# Altium schematic sheet 06_SOM_USB_CARD.SchDoc
size 420 x 297 mm; SheetNumber: 10; SheetTotal: 29
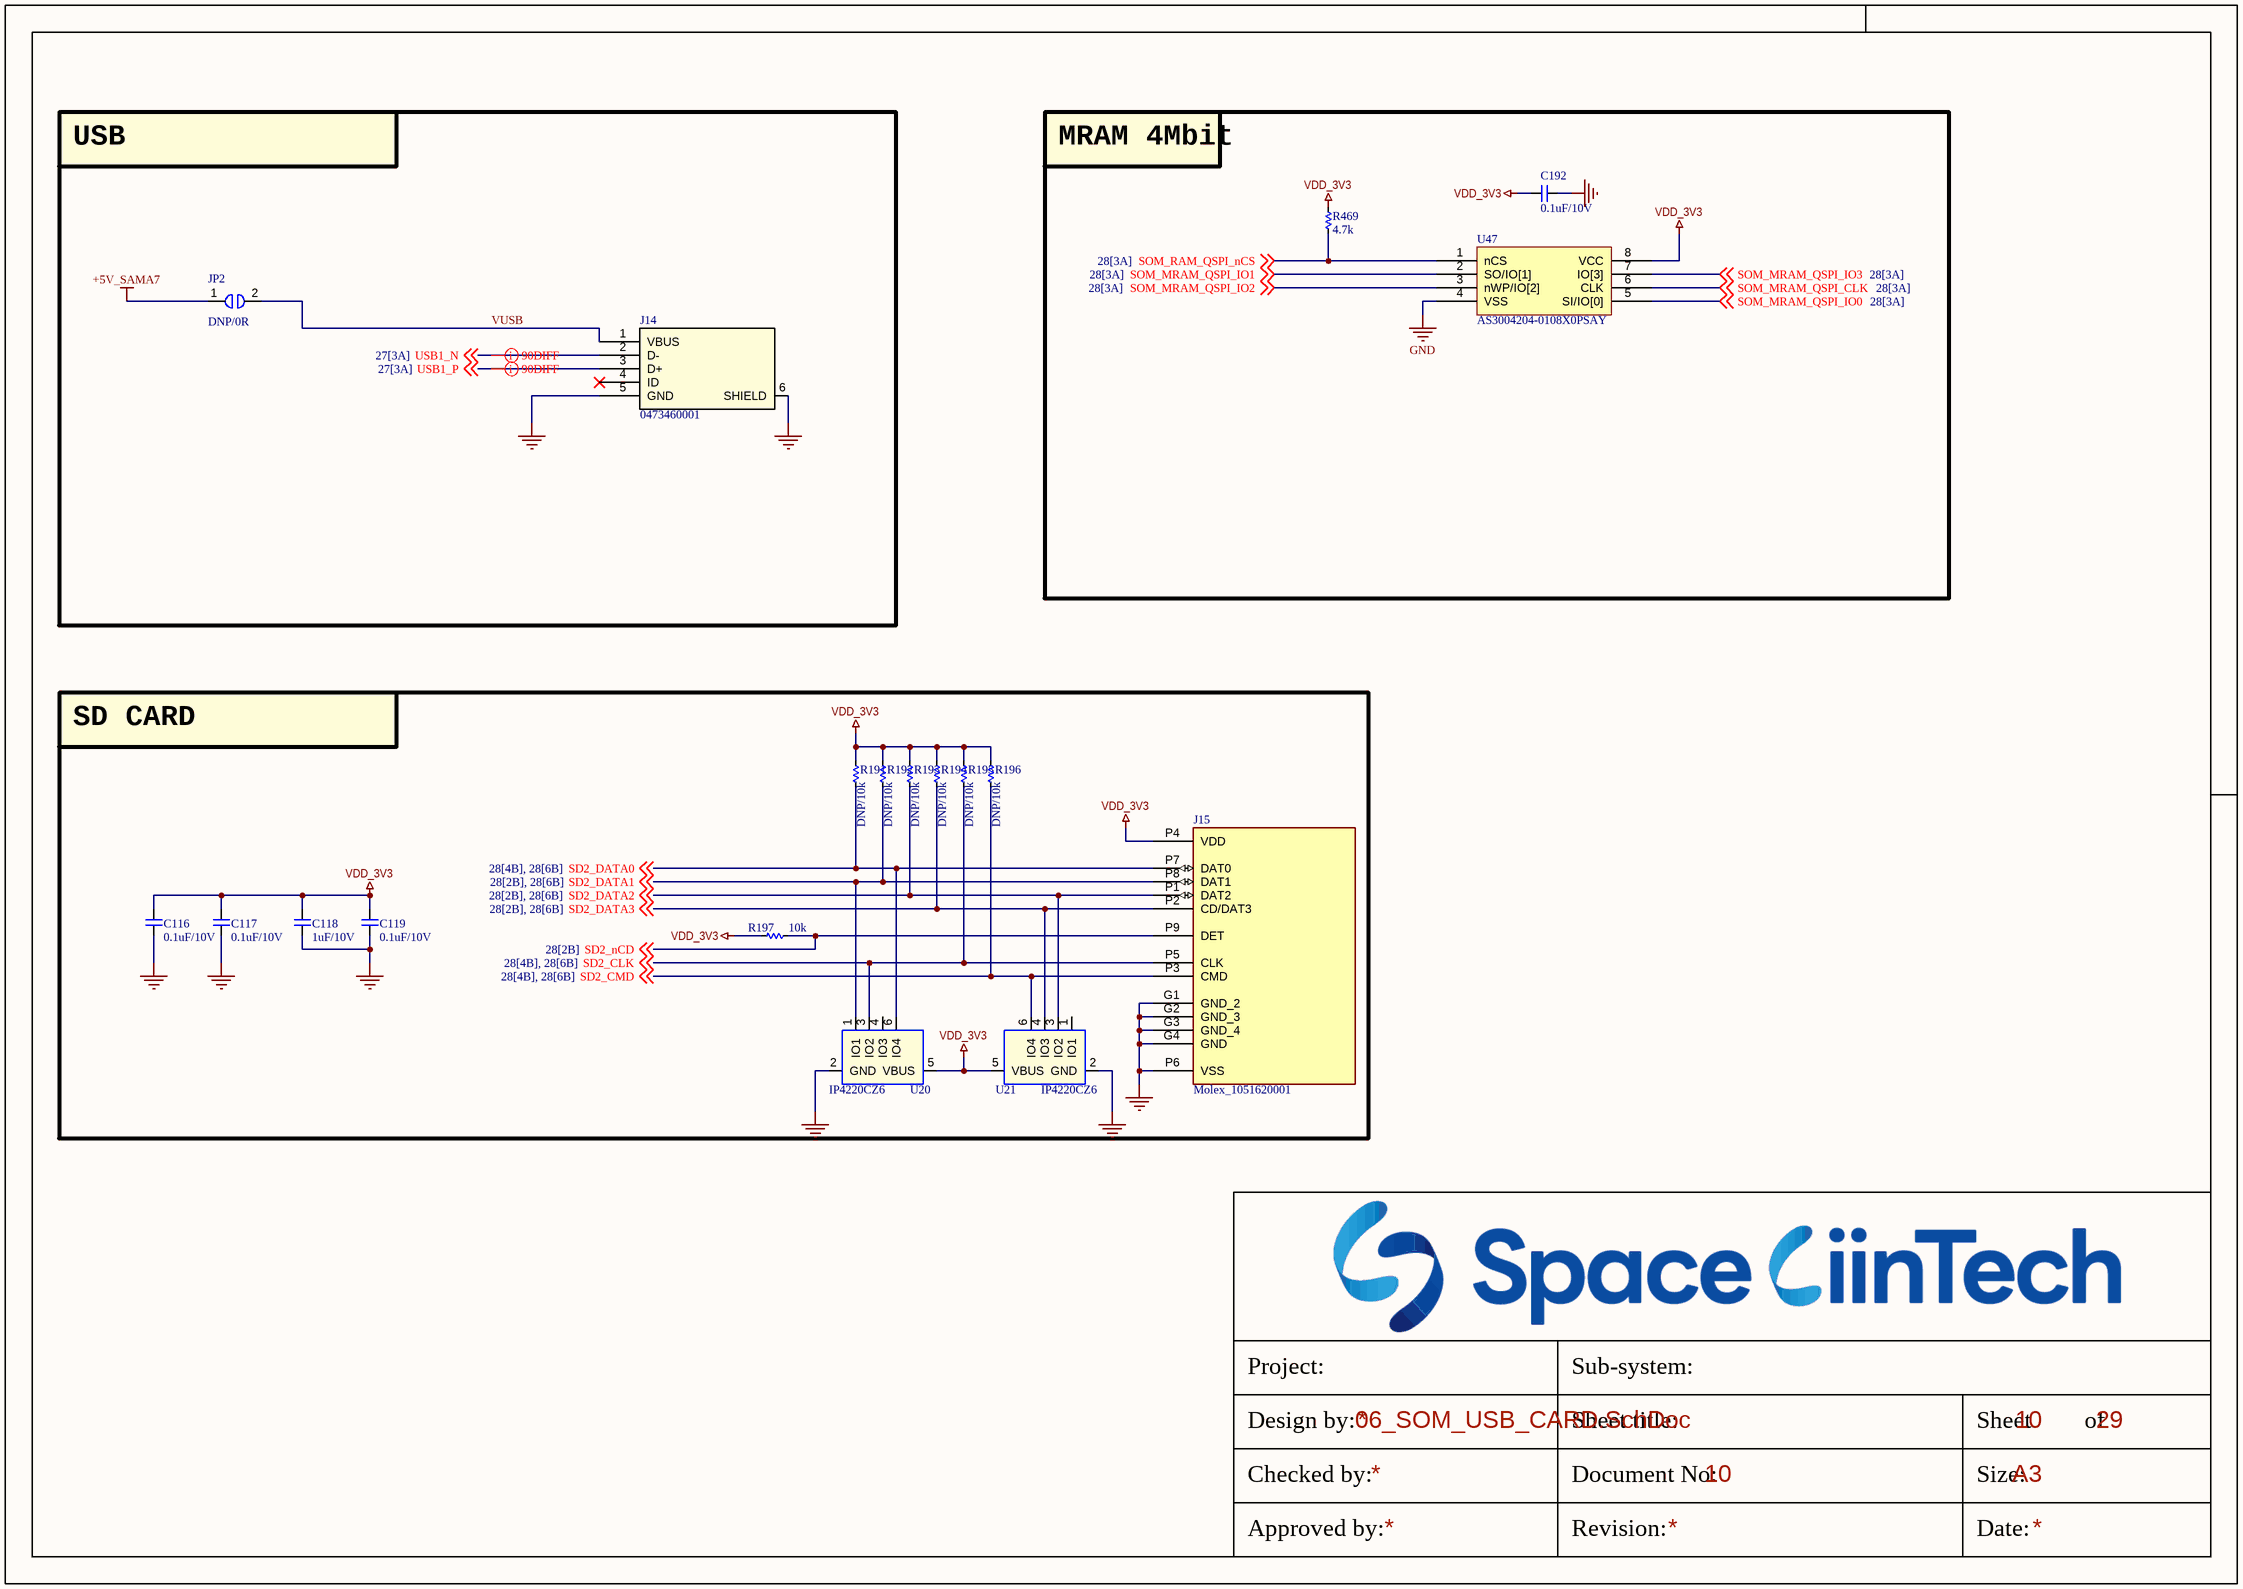
[diagram p0: 06_SOM_USB_CARD.SchDoc]

## Parts
C116  0.1uF/10V  [CAP_C_1005X60]
C117  0.1uF/10V  [CAP_C_1005X60]
C118  1uF/10V  [CAP_C_1005X60]
C119  0.1uF/10V  [CAP_C_1005X60]
C192  0.1uF/10V  [CAP_C_1005X60]
J14  0473460001  [47346-0001_MOL]
J15  Molex_1051620001  [Molex_1051620001]
JP2  DNP/0R  [RES_C_1608X60]
R191  DNP/10k  [RES_C_1005X40]
R192  DNP/10k  [RES_C_1005X40]
R193  DNP/10k  [RES_C_1005X40]
R194  DNP/10k  [RES_C_1005X40]
R195  DNP/10k  [RES_C_1005X40]
R196  DNP/10k  [RES_C_1005X40]
R197  10k  [RES_C_1005X40]
R469  4.7k  [RES_C_1005X40]
U20  IP4220CZ6  [SOT95P280X145-6N]
U21  IP4220CZ6  [SOT95P280X145-6N]
U47  AS3004204-0108X0PSAY  [SOIC127P790X216-8]

## Blocks framed on the sheet
USB: J14 JP2
MRAM 4Mbit: C192 R469 U47
SD CARD: C116-C119 J15 R191-R197 U20 U21

## Nets
+5V_SAMA7: JP2.1
GND: C116.1 C117.1 C118.1 C119.1 C192.1 J14.5(GND) J14.6(SHIELD) J15.G1(GND_2) J15.G2(GND_3) J15.G3(GND_4) J15.G4(GND) J15.P6(VSS) U20.2(GND) U21.2(GND) U47.4(VSS)
VDD_3V3: C116.2 C117.2 C118.2 C119.2 C192.2 J15.P4(VDD) R191.2 R192.2 R193.2 R194.2 R195.2 R196.2 R197.1 R469.2 U20.5(VBUS) U21.5(VBUS) U47.8(VCC)
SD2_CLK: J15.P5(CLK) R195.1 U20.3(IO2) ; off-sheet SD2_CLK
SD2_CMD: J15.P3(CMD) R196.1 U21.6(IO4) ; off-sheet SD2_CMD
SD2_DATA0: J15.P7(DAT0) R191.1 U20.6(IO4) ; off-sheet SD2_DATA0
SD2_DATA1: J15.P8(DAT1) R192.1 U20.1(IO1) ; off-sheet SD2_DATA1
SD2_DATA2: J15.P1(DAT2) R193.1 U21.3(IO2) ; off-sheet SD2_DATA2
SD2_DATA3: J15.P2(CD/DAT3) R194.1 U21.4(IO3) ; off-sheet SD2_DATA3
SD2_nCD: J15.P9(DET) R197.2 ; off-sheet SD2_nCD
SOM_MRAM_QSPI_CLK: U47.6(CLK) ; off-sheet SOM_MRAM_QSPI_CLK
SOM_MRAM_QSPI_IO0: U47.5(SI/IO[0]) ; off-sheet SOM_MRAM_QSPI_IO0
SOM_MRAM_QSPI_IO1: U47.2(SO/IO[1]) ; off-sheet SOM_MRAM_QSPI_IO1
SOM_MRAM_QSPI_IO2: U47.3(nWP/IO[2]) ; off-sheet SOM_MRAM_QSPI_IO2
SOM_MRAM_QSPI_IO3: U47.7(IO[3]) ; off-sheet SOM_MRAM_QSPI_IO3
SOM_RAM_QSPI_nCS: R469.1 U47.1(nCS) ; off-sheet SOM_RAM_QSPI_nCS
USB1_N: J14.2(D-) ; off-sheet USB1_N
USB1_P: J14.3(D+) ; off-sheet USB1_P
VUSB: J14.1(VBUS) JP2.2

Not connected (* = marked no-connect by the designer): J14 4(ID)*; U20 4(IO3); U21 1(IO1)

## Layout directives
differential pair; differential pair class DIFF90: USB1_N, USB1_P

## Notes on the sheet
- Project:
- Sub-system:
- Design by:
- Sheet title:
- Sheet
- of
- Checked by:
- Approved by:
- Revision:
- Document No:
- Size:
- Date:
- A3

## Library data of the parts
C116-C119 C192 = _CAP_C_2: CAP CHIP
J14 = USB_micro: No Description Available; Mfr_Name: Molex Connector Corporation; RefDes: RefDes; Type: Type
J15 = Molex_1051620001: 9 (8 + 1) Position Card Connector Secure Digital - microSDâ„¢ Surface Mount, Right Angle Gold; MF: Molex; SnapEDA_Link: https://www.snapeda.com/parts/1051620001/Molex/view-part/?ref=snap; Package: None; Value: *; MP: 1051620001; Check_prices: https://www.snapeda.com/parts/1051620001/Molex/view-part/?ref=eda
JP2 = JUMPER_1_1
R191-R197 R469 = _RES_B_2: RES
U20 U21 = IP4220CZ6_0: P/N: 132D42200S; PCB Footprint: SOT23-6L; CLABCONF0: =SB-UCMIMX93
U47 = IC_RAM_AS3004204-0108X0PSAY